# Altium project ST-LINK.PrjPcb
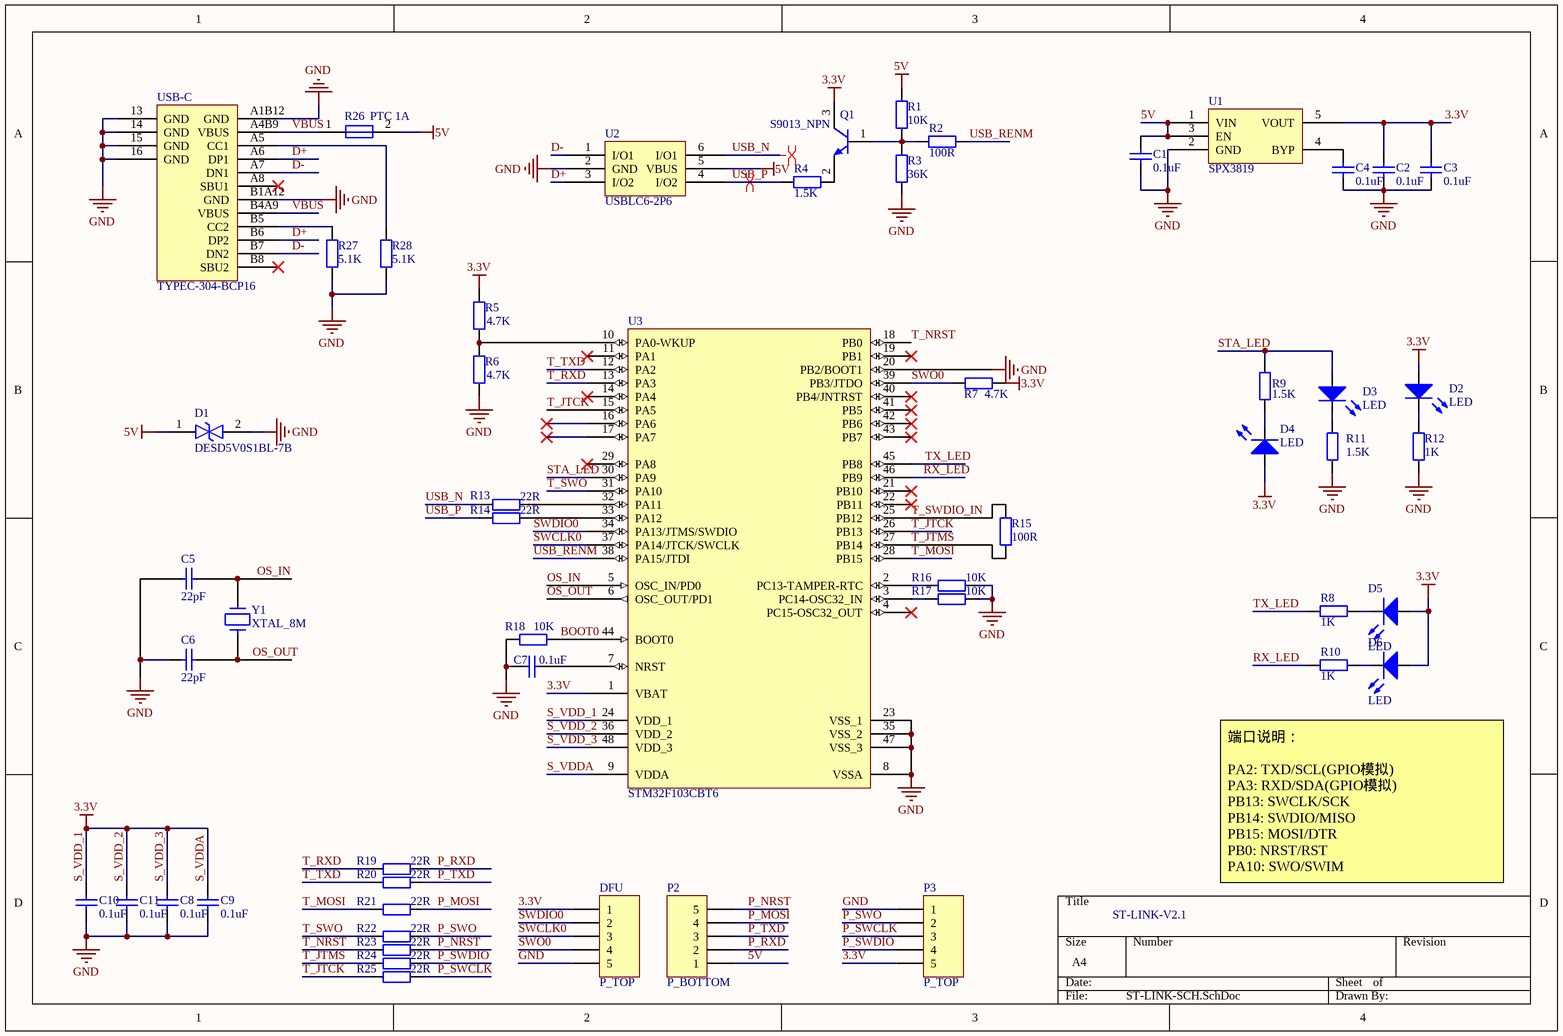
[diagram p0: ST-LINK-SCH.SchDoc]
1 sheet, 54 parts. Net scope: global (net labels, ports and power ports of the same name join across sheets).
Board file: ST-LINK-PCB.PcbDoc

## Sheet ST-LINK-SCH.SchDoc
size A4

### Parts
C1  value 0.1uF  [0402C]  (hidden comment: Cap)
C2  value 0.1uF  [0402C]  (hidden comment: Cap)
C3  value 0.1uF  [0402C]  (hidden comment: Cap)
C4  value 0.1uF  [0402C]  (hidden comment: Cap)
C5  value 22pF  [0402C]  (hidden comment: Cap)
C6  value 22pF  [0402C]  (hidden comment: Cap)
C7  value 0.1uF  [0402C]  (hidden comment: Cap)
C8  value 0.1uF  [0402C]  (hidden comment: Cap)
C9  value 0.1uF  [0402C]  (hidden comment: Cap)
C10  value 0.1uF  [0402C]  (hidden comment: Cap)
C11  value 0.1uF  [0402C]  (hidden comment: Cap)
D1  DESD5V0S1BL-7B  [DESD5V0S1BL-7B]
D2  LED  [0603LED]
D3  LED  [0603LED]
D4  LED  [0603LED]
D5  LED  [0603LED]
D6  LED  [0603LED]
DFU  P_TOP  [SIP5-1.27]
P2  P_BOTTOM  [HEADER 5]
P3  P_TOP  [HEADER 5]
Q1  S9013_NPN  [SOT-23-3]
R1  value 10K  [0402R]  (hidden comment: Res1)
R2  value 100R  [0402R]  (hidden comment: Res1)
R3  value 36K  [0402R]  (hidden comment: Res1)
R4  value 1.5K  [0402R]  (hidden comment: Res1)
R5  value 4.7K  [0402R]  (hidden comment: Res2)
R6  value 4.7K  [0402R]  (hidden comment: Res2)
R7  value 4.7K  [0402R]  (hidden comment: Res2)
R8  value 1K  [0402R]  (hidden comment: Res2)
R9  value 1.5K  [0402R]  (hidden comment: Res2)
R10  value 1K  [0402R]  (hidden comment: Res2)
R11  value 1.5K  [0402R]  (hidden comment: Res2)
R12  value 1K  [0402R]  (hidden comment: Res2)
R13  value 22R  [0402R]  (hidden comment: Res2)
R14  value 22R  [0402R]  (hidden comment: Res2)
R15  value 100R  [0402R]  (hidden comment: Res2)
R16  value 10K  [0402R]  (hidden comment: Res1)
R17  value 10K  [0402R]  (hidden comment: Res1)
R18  value 10K  [0402R]  (hidden comment: Res2)
R19  value 22R  [0402R]  (hidden comment: Res2)
R20  value 22R  [0402R]  (hidden comment: Res2)
R21  value 22R  [0402R]  (hidden comment: Res2)
R22  value 22R  [0402R]  (hidden comment: Res2)
R23  value 22R  [0402R]  (hidden comment: Res2)
R24  value 22R  [0402R]  (hidden comment: Res2)
R25  value 22R  [0402R]  (hidden comment: Res2)
R26  PTC 1A  [PTC_1A]
R27  value 5.1K  [0402R]  (hidden comment: Res2)
R28  value 5.1K  [0402R]  (hidden comment: Res2)
U1  SPX3819  [SPX3819]
U2  USBLC6-2P6  [USBLC6-2P6]
U3  STM32F103CBT6  [LQFP48_L]
USB-C  TYPEC-304-BCP16  [TYPE-C-16P]
Y1  XTAL_8M  [SMD-5032_2P]

### Nets
3.3V: C2.2 C3.2 C8.2 C9.2 C10.2 C11.2 D2.1 D4.1 D5.1 D6.1 DFU.1 P3.5 Q1.3(C) R5.2 R7.2 U1.5(VOUT) U3.1(VBAT) U3.9(VDDA) U3.24(VDD_1) U3.36(VDD_2) U3.48(VDD_3)  [also labelled S_VDD_1, S_VDD_2, S_VDD_3, S_VDDA]
5V: C1.2 D1.1 P2.1 R1.1 R26.2 U1.1(VIN) U1.3(EN) U2.5(VBUS)
GND: C1.1 C2.1 C3.1 C4.1 C5.1 C6.1 C7.1 C8.1 C9.1 C10.1 C11.1 D1.2 DFU.5 P3.1 R3.2 R6.1 R11.1 R12.1 R16.2 R17.2 R18.1 R27.1 R28.1 U1.2(GND) U2.2(GND) U3.8(VSSA) U3.20(PB2/BOOT1) U3.23(VSS_1) U3.35(VSS_2) U3.47(VSS_3) USB-C.13(GND) USB-C.14(GND) USB-C.15(GND) USB-C.16(GND) USB-C.A1B12(GND) USB-C.B1A12(GND)
BOOT0: R18.2 U3.44(BOOT0)
D+: U2.3(I/O2) USB-C.A6(DP1) USB-C.B6(DP2)
D-: U2.1(I/O1) USB-C.A7(DN1) USB-C.B7(DN2)
OS_IN: C5.2 U3.5(OSC_IN/PD0) Y1.2
OS_OUT: C6.2 U3.6(OSC_OUT/PD1) Y1.1
P_MOSI: P2.4 R21.2
P_NRST: P2.5 R23.2
P_RXD: P2.2 R19.2
P_SWCLK: P3.3 R25.2
P_SWDIO: P3.4 R24.2
P_SWO: P3.2 R22.2
P_TXD: P2.3 R20.2
RX_LED: R10.1 U3.46(PB9)
STA_LED: D3.1 R9.2 U3.30(PA9)
SWCLK0: DFU.3 U3.37(PA14/JTCK/SWCLK)
SWDIO0: DFU.2 U3.34(PA13/JTMS/SWDIO)
SWO0: DFU.4 R7.1 U3.39(PB3/JTDO)
T_JTCK: R25.1 U3.15(PA5) U3.26(PB13)
T_JTMS: R15.1 R24.1 U3.27(PB14)
T_MOSI: R21.1 U3.28(PB15)
T_NRST: R23.1 U3.18(PB0)
T_RXD: R19.1 U3.13(PA3)
T_SWDIO_IN: R15.2 U3.25(PB12)
T_SWO: R22.1 U3.31(PA10)
T_TXD: R20.1 U3.12(PA2)
TX_LED: R8.1 U3.45(PB8)
USB_N: R13.1 U2.6(I/O1)
USB_P: R4.2 R14.1 U2.4(I/O2)
USB_RENM: R2.2 U3.38(PA15/JTDI)
VBUS: R26.1 USB-C.A4B9(VBUS) USB-C.B4A9(VBUS)
NetC4_2: C4.2 U1.4(BYP)
NetC7_2: C7.2 U3.7(NRST)
NetD2_2: D2.2 R12.2
NetD3_2: D3.2 R11.2
NetD4_2: D4.2 R9.1
NetD5_2: D5.2 R8.2
NetD6_2: D6.2 R10.2
NetQ1_1: Q1.1(B) R1.2 R2.1 R3.1
NetQ1_2: Q1.2(E) R4.1
NetR5_1: R5.1 R6.2 U3.10(PA0-WKUP)
NetR13_2: R13.2 U3.32(PA11)
NetR14_2: R14.2 U3.33(PA12)
NetR16_1: R16.1 U3.2(PC13-TAMPER-RTC)
NetR17_1: R17.1 U3.3(PC14-OSC32_IN)
NetR27_2: R27.2 USB-C.B5(CC2)
NetR28_2: R28.2 USB-C.A5(CC1)

Not connected (* = marked no-connect by the designer): U3 4(PC15-OSC32_OUT)* 11(PA1)* 14(PA4)* 16(PA6)* 17(PA7)* 19(PB1)* 21(PB10)* 22(PB11)* 29(PA8)* 40(PB4/JNTRST)* 41(PB5)* 42(PB6)* 43(PB7)*; USB-C A8(SBU1)* B8(SBU2)*

### Layout directives
differential pair: USB_N, USB_P

### Notes on the sheet
- ST-LINK-V2.1
- 端口说明：
  PA2: TXD/SCL(GPIO模拟)
  PA3: RXD/SDA(GPIO模拟)
  PB13: SWCLK/SCK
  PB14: SWDIO/MISO
  PB15: MOSI/DTR
  PB0: NRST/RST
  PA10: SWO/SWIM

### Library data of the parts
C1-C11 = Cap: Capacitor; Published: 8-Jun-2000; LatestRevisionDate: 17-Jul-2002; LatestRevisionNote: Re-released for DXP Platform.; PackageReference: RAD-0.3; Publisher: Altium Limited; PackageDescription: Radial Cap, Thru-Hole; 2 Leads; 0.3 in Pin Spacing
D1 = DESD5V0S1BL-7B: 1CHANNEL ESD
D2-D6 = LED: Typical RED, GREEN, YELLOW, AMBER GaAs LED; Published: 8-Jun-2000; LatestRevisionDate: 17-Jul-2002; LatestRevisionNote: Re-released for DXP Platform.; PackageVersion: Feb-2002; PackageReference: 3.2X1.6X1.1; Publisher: Altium Limited; PackageDescription: SM LED; 2 Flat Leads
DFU P2 P3 = Header 5: Header, 5-Pin; LatestRevisionDate: 17-Jul-2002; LatestRevisionNote: Re-released for DXP Platform.; Publisher: Altium Limited
Q1 = S9013: Published: 8-Jun-2000; LatestRevisionDate: 15-Jan-2003; LatestRevisionNote: PCB Footprint 'BCY-W3/D4.7' replaced; DatasheetDocument: 1997; PackageDocument: Sep-1998; PackageReference: TO-92A; Publisher: Altium Limited; Code_JEDEC: TO-92A
R1-R4 R16 R17 = Res1: 贴片电阻; Published: 8-Jun-2000; LatestRevisionDate: 17-Jul-2002; LatestRevisionNote: Re-released for DXP Platform.; PackageReference: AXIAL-0.4; Publisher: Altium Limited
R5-R15 R18-R25 = Res2: Resistor; Published: 8-Jun-2000; LatestRevisionDate: 17-Jul-2002; LatestRevisionNote: Re-released for DXP Platform.; PackageReference: AXIAL-0.4; Publisher: Altium Limited; PackageDescription: Axial Device, Thru-Hole; 2 Leads; 0.4 in Pin Spacing
R26 = PTC保险
R27 R28 = Res: Resistor; Published: 8-Jun-2000; LatestRevisionDate: 17-Jul-2002; LatestRevisionNote: Re-released for DXP Platform.; PackageReference: AXIAL-0.4; Publisher: Altium Limited; PackageDescription: Axial Device, Thru-Hole; 2 Leads; 0.4 in Pin Spacing
U1 = SPX3819: SPX3819_5VTO3V3_LDO
U2 = USBLC6-2P6: ESD PROTECTION
U3 = STM32F103CBT6: STM32 ARM-based 32-bit MCU with 128 Kbytes Flash, 48-pin LQFP, Industrial Temperature; Published: 30-May-2008; DatasheetVersion: rev6, Mar-2008; PackageVersion: Mar-2008; PackageReference: LQFP48; Publisher: Altium Limited; PackageDescription: 48-Pin Low-Profile Quad Flat Pack, 7 x 7 mm Body, 0.5 mm Pitch (LQFP48); ComponentLink1Description: Manufacturer Link; ComponentLink1URL: www.st.com/stm32; ComponentLink2Description: Datasheet; ComponentLink2URL: http://www.st.com/stonline/products/literature/ds/13587.pdf
USB-C = TYPEC-304-BCP16: TYPEC-16P
Y1 = XTAL